# EAGLE design 10004_epic_cape (EAGLE 6.3)

## Sheet 1 of 3
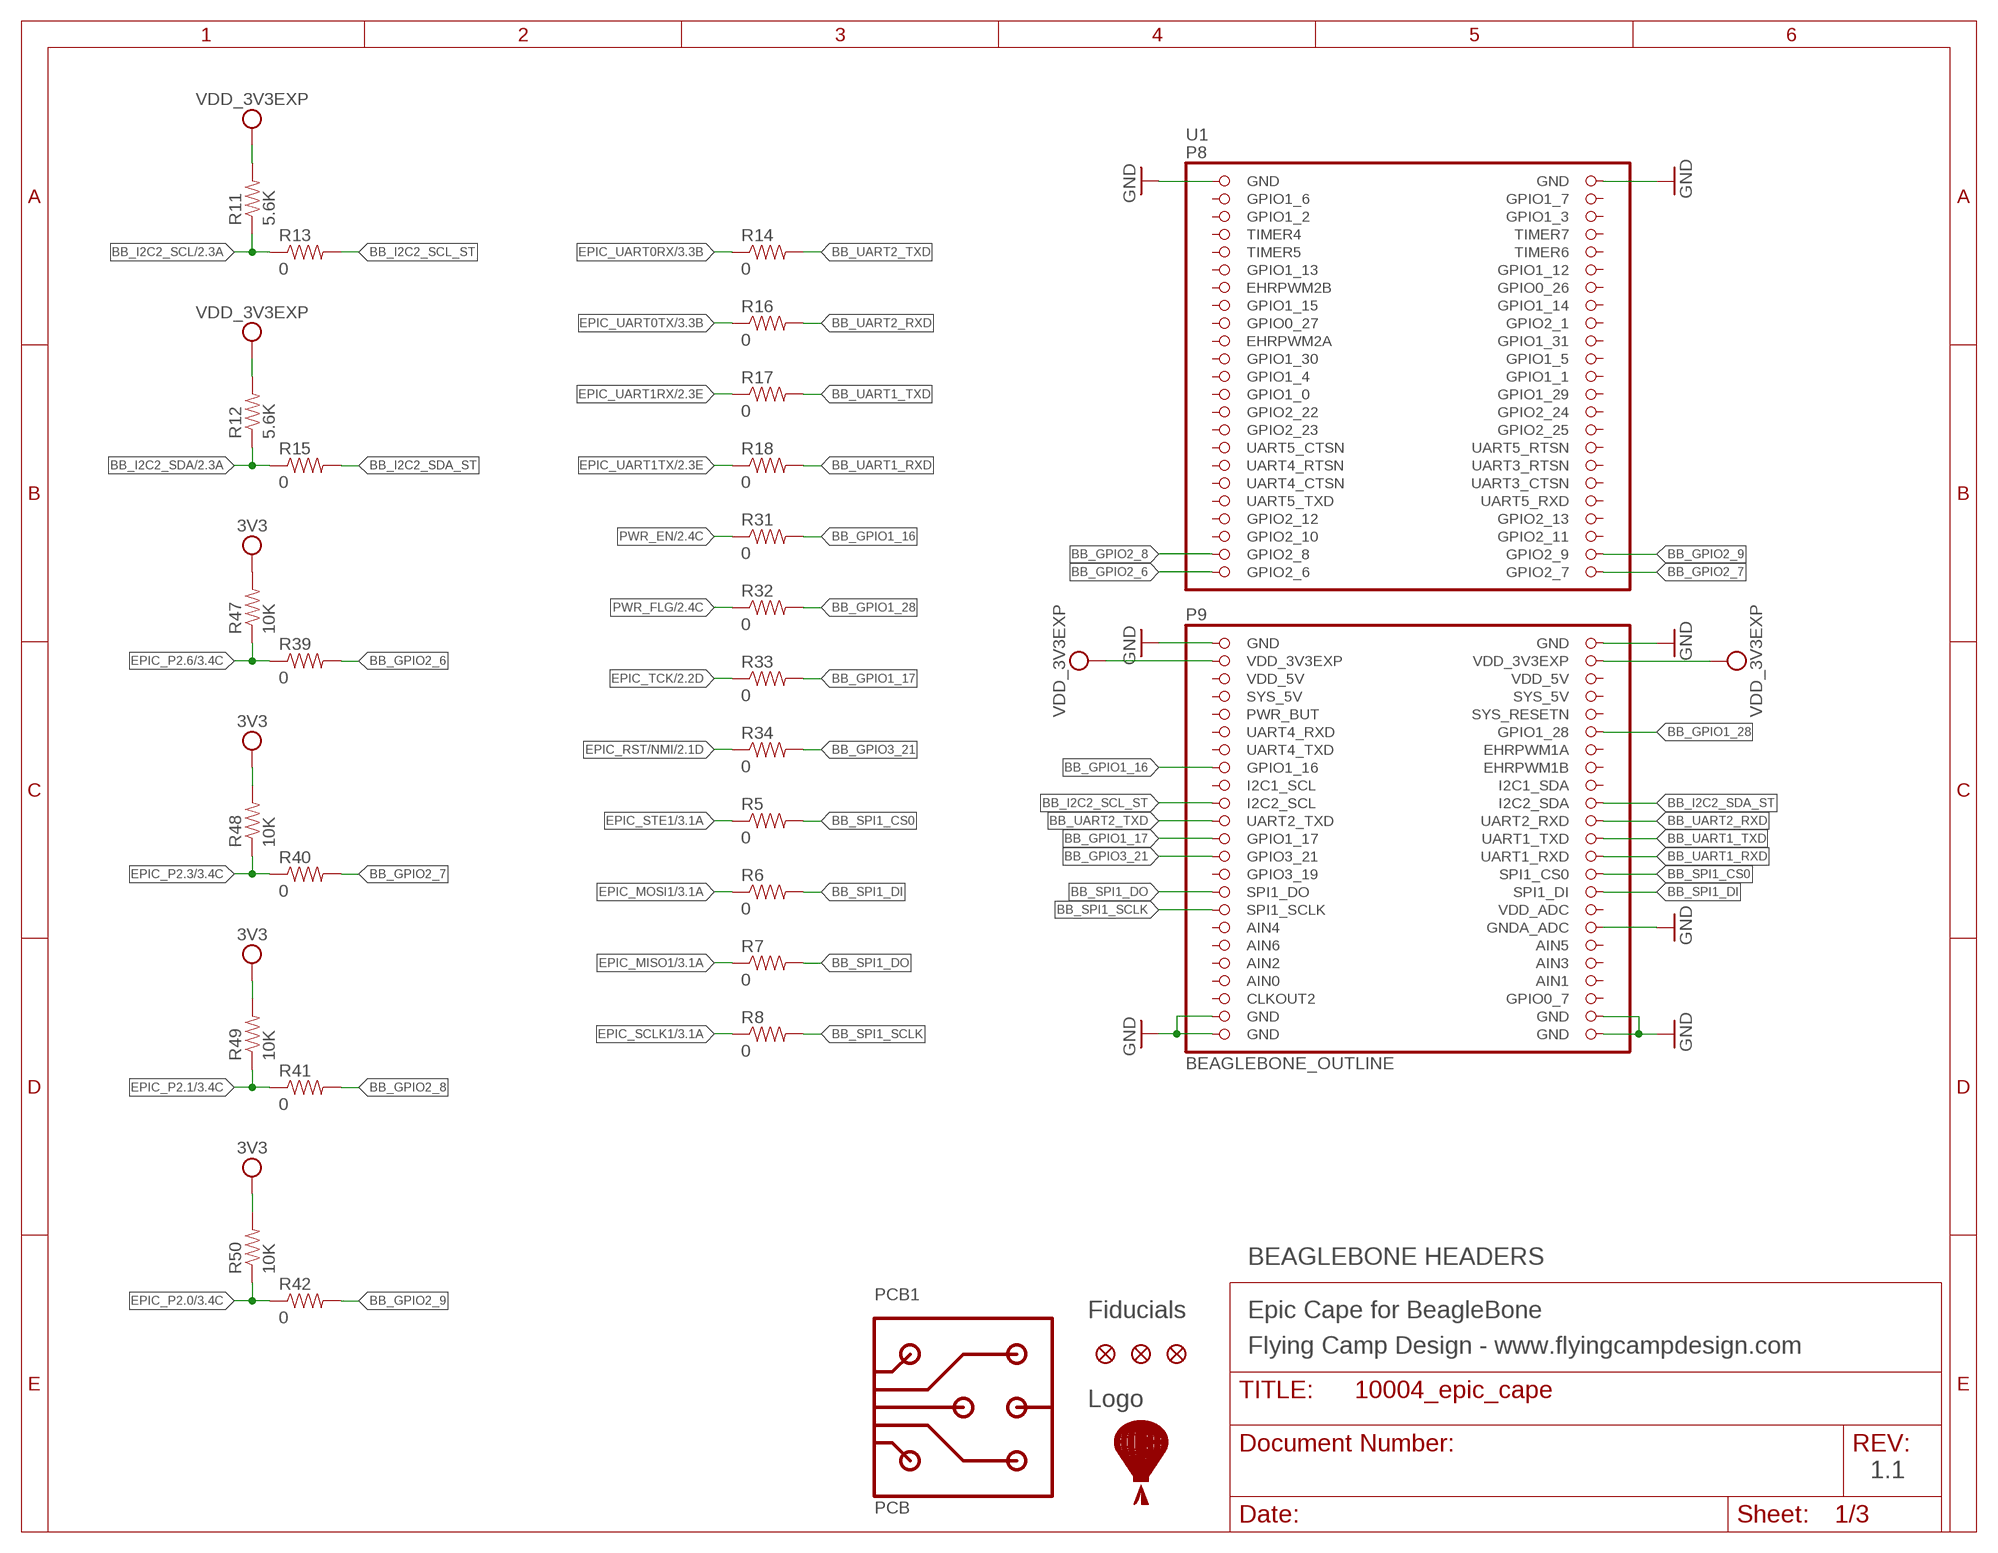
[diagram p0: schematic, sheet 1]
PCB1 (PCB): MFR: Flying Camp Design; MPN: 10004

### Parts
R5  0  RESISTOR1005  [RESC1005]
R6  0  RESISTOR1005  [RESC1005]
R7  0  RESISTOR1005  [RESC1005]
R8  0  RESISTOR1005  [RESC1005]
R11  5.6K  RESISTOR1005  [RESC1005]
R12  5.6K  RESISTOR1005  [RESC1005]
R13  0  RESISTOR1005  [RESC1005]
R14  0  RESISTOR1005  [RESC1005]
R15  0  RESISTOR1005  [RESC1005]
R16  0  RESISTOR1005  [RESC1005]
R17  0  RESISTOR1005  [RESC1005]
R18  0  RESISTOR1005  [RESC1005]
R31  0  RESISTOR1005  [RESC1005]
R32  0  RESISTOR1005  [RESC1005]
R33  0  RESISTOR1005  [RESC1005]
R34  0  RESISTOR1005  [RESC1005]
R39  0  RESISTOR1005  [RESC1005]
R40  0  RESISTOR1005  [RESC1005]
R41  0  RESISTOR1005  [RESC1005]
R42  0  RESISTOR1005  [RESC1005]
R47  10K  RESISTOR1005  [RESC1005]
R48  10K  RESISTOR1005  [RESC1005]
R49  10K  RESISTOR1005  [RESC1005]
R50  10K  RESISTOR1005  [RESC1005]
U1  BEAGLEBONE_OUTLINE  [BEAGLEBONE_SHIELD]
U$2  LOGO  [LOGO]
U$3  FIDUCIAL1X2.5  [FIDUCIAL-1X2.5]
U$4  FIDUCIAL1X2.5  [FIDUCIAL-1X2.5]
U$5  FIDUCIAL1X2.5  [FIDUCIAL-1X2.5]

### Nets
3V3: R47.2 R48.2 R49.2 R50.2 ; also sheet 2,3
BB_GPIO1_16: R31.2 U1.61(GPIO1_16)
BB_GPIO1_17: R33.2 U1.69(GPIO1_17)
BB_GPIO1_28: R32.2 U1.58(GPIO1_28)
BB_GPIO2_6: R39.2 U1.45(GPIO2_6)
BB_GPIO2_7: R40.2 U1.46(GPIO2_7)
BB_GPIO2_8: R41.2 U1.43(GPIO2_8)
BB_GPIO2_9: R42.2 U1.44(GPIO2_9)
BB_GPIO3_21: R34.2 U1.71(GPIO3_21)
BB_I2C2_SCL: R11.1 R13.1 ; also sheet 2
BB_I2C2_SCL_ST: R13.2 U1.65(I2C2_SCL)
BB_I2C2_SDA: R12.1 R15.1 ; also sheet 2
BB_I2C2_SDA_ST: R15.2 U1.66(I2C2_SDA)
BB_SPI1_CS0: R5.2 U1.74(SPI1_CS0)
BB_SPI1_DI: R6.2 U1.76(SPI1_DI)
BB_SPI1_DO: R7.2 U1.75(SPI1_DO)
BB_SPI1_SCLK: R8.2 U1.77(SPI1_SCLK)
BB_UART1_RXD: R18.2 U1.72(UART1_RXD)
BB_UART1_TXD: R17.2 U1.70(UART1_TXD)
BB_UART2_RXD: R16.2 U1.68(UART2_RXD)
BB_UART2_TXD: R14.2 U1.67(UART2_TXD)
EPIC_MISO1: R7.1 ; also sheet 3
EPIC_MOSI1: R6.1 ; also sheet 3
EPIC_P2.0: R42.1 R50.1 ; also sheet 3
EPIC_P2.1: R41.1 R49.1 ; also sheet 3
EPIC_P2.3: R40.1 R48.1 ; also sheet 3
EPIC_P2.6: R39.1 R47.1 ; also sheet 3
EPIC_RST/NMI: R34.1 ; also sheet 2,3
EPIC_SCLK1: R8.1 ; also sheet 3
EPIC_STE1: R5.1 ; also sheet 3
EPIC_TCK: R33.1 ; also sheet 2,3
EPIC_UART0RX: R14.1 ; also sheet 3
EPIC_UART0TX: R16.1 ; also sheet 3
EPIC_UART1RX: R17.1 ; also sheet 2,3
EPIC_UART1TX: R18.1 ; also sheet 2,3
GND: U1.1(GND) U1.2(GND) U1.47(GND) U1.48(GND) U1.80(GNDA_ADC) U1.89(GND) U1.90(GND) U1.91(GND) U1.92(GND) ; also sheet 2,3
PWR_EN: R31.1 ; also sheet 2
PWR_FLG: R32.1 ; also sheet 2
VDD_3V3EXP: R11.2 R12.2 U1.49(VDD_3V3EXP) U1.50(VDD_3V3EXP) ; also sheet 2
Unconnected: U1.5(GPIO1_2) U1.6(GPIO1_3) U1.7(TIMER4) U1.8(TIMER7) U1.9(TIMER5) U1.10(TIMER6) U1.11(GPIO1_13) U1.12(GPIO1_12) U1.13(EHRPWM2B) U1.14(GPIO0_26) U1.15(GPIO1_15) U1.16(GPIO1_14) U1.17(GPIO0_27) U1.18(GPIO2_1) U1.19(EHRPWM2A) U1.20(GPIO1_31) U1.21(GPIO1_30) U1.22(GPIO1_5) U1.23(GPIO1_4) U1.24(GPIO1_1) U1.25(GPIO1_0) U1.26(GPIO1_29) U1.27(GPIO2_22) U1.28(GPIO2_24) U1.29(GPIO2_23) U1.30(GPIO2_25) U1.31(UART5_CTSN) U1.32(UART5_RTSN) U1.33(UART4_RTSN) U1.34(UART3_RTSN) U1.35(UART4_CTSN) U1.36(UART3_CTSN) U1.37(UART5_TXD) U1.38(UART5_RXD) U1.39(GPIO2_12) U1.40(GPIO2_13) U1.41(GPIO2_10) U1.53(SYS_5V) U1.54(SYS_5V) U1.55(PWR_BUT) U1.56(SYS_RESETN) U1.57(UART4_RXD) U1.59(UART4_TXD) U1.60(EHRPWM1A) U1.62(EHRPWM1B) U1.63(I2C1_SCL) U1.64(I2C1_SDA) U1.73(GPIO3_19) U1.78(VDD_ADC) U1.79(AIN4) U1.81(AIN6) U1.82(AIN5) U1.83(AIN2) U1.86(AIN1) U1.87(CLKOUT2) U1.88(GPIO0_7)

### Notes on the sheet
- BEAGLEBONE HEADERS
- Fiducials | Epic Cape for BeagleBone
- Flying Camp Design - www.flyingcampdesign.com
- Logo
- 1.1

## Sheet 2 of 3
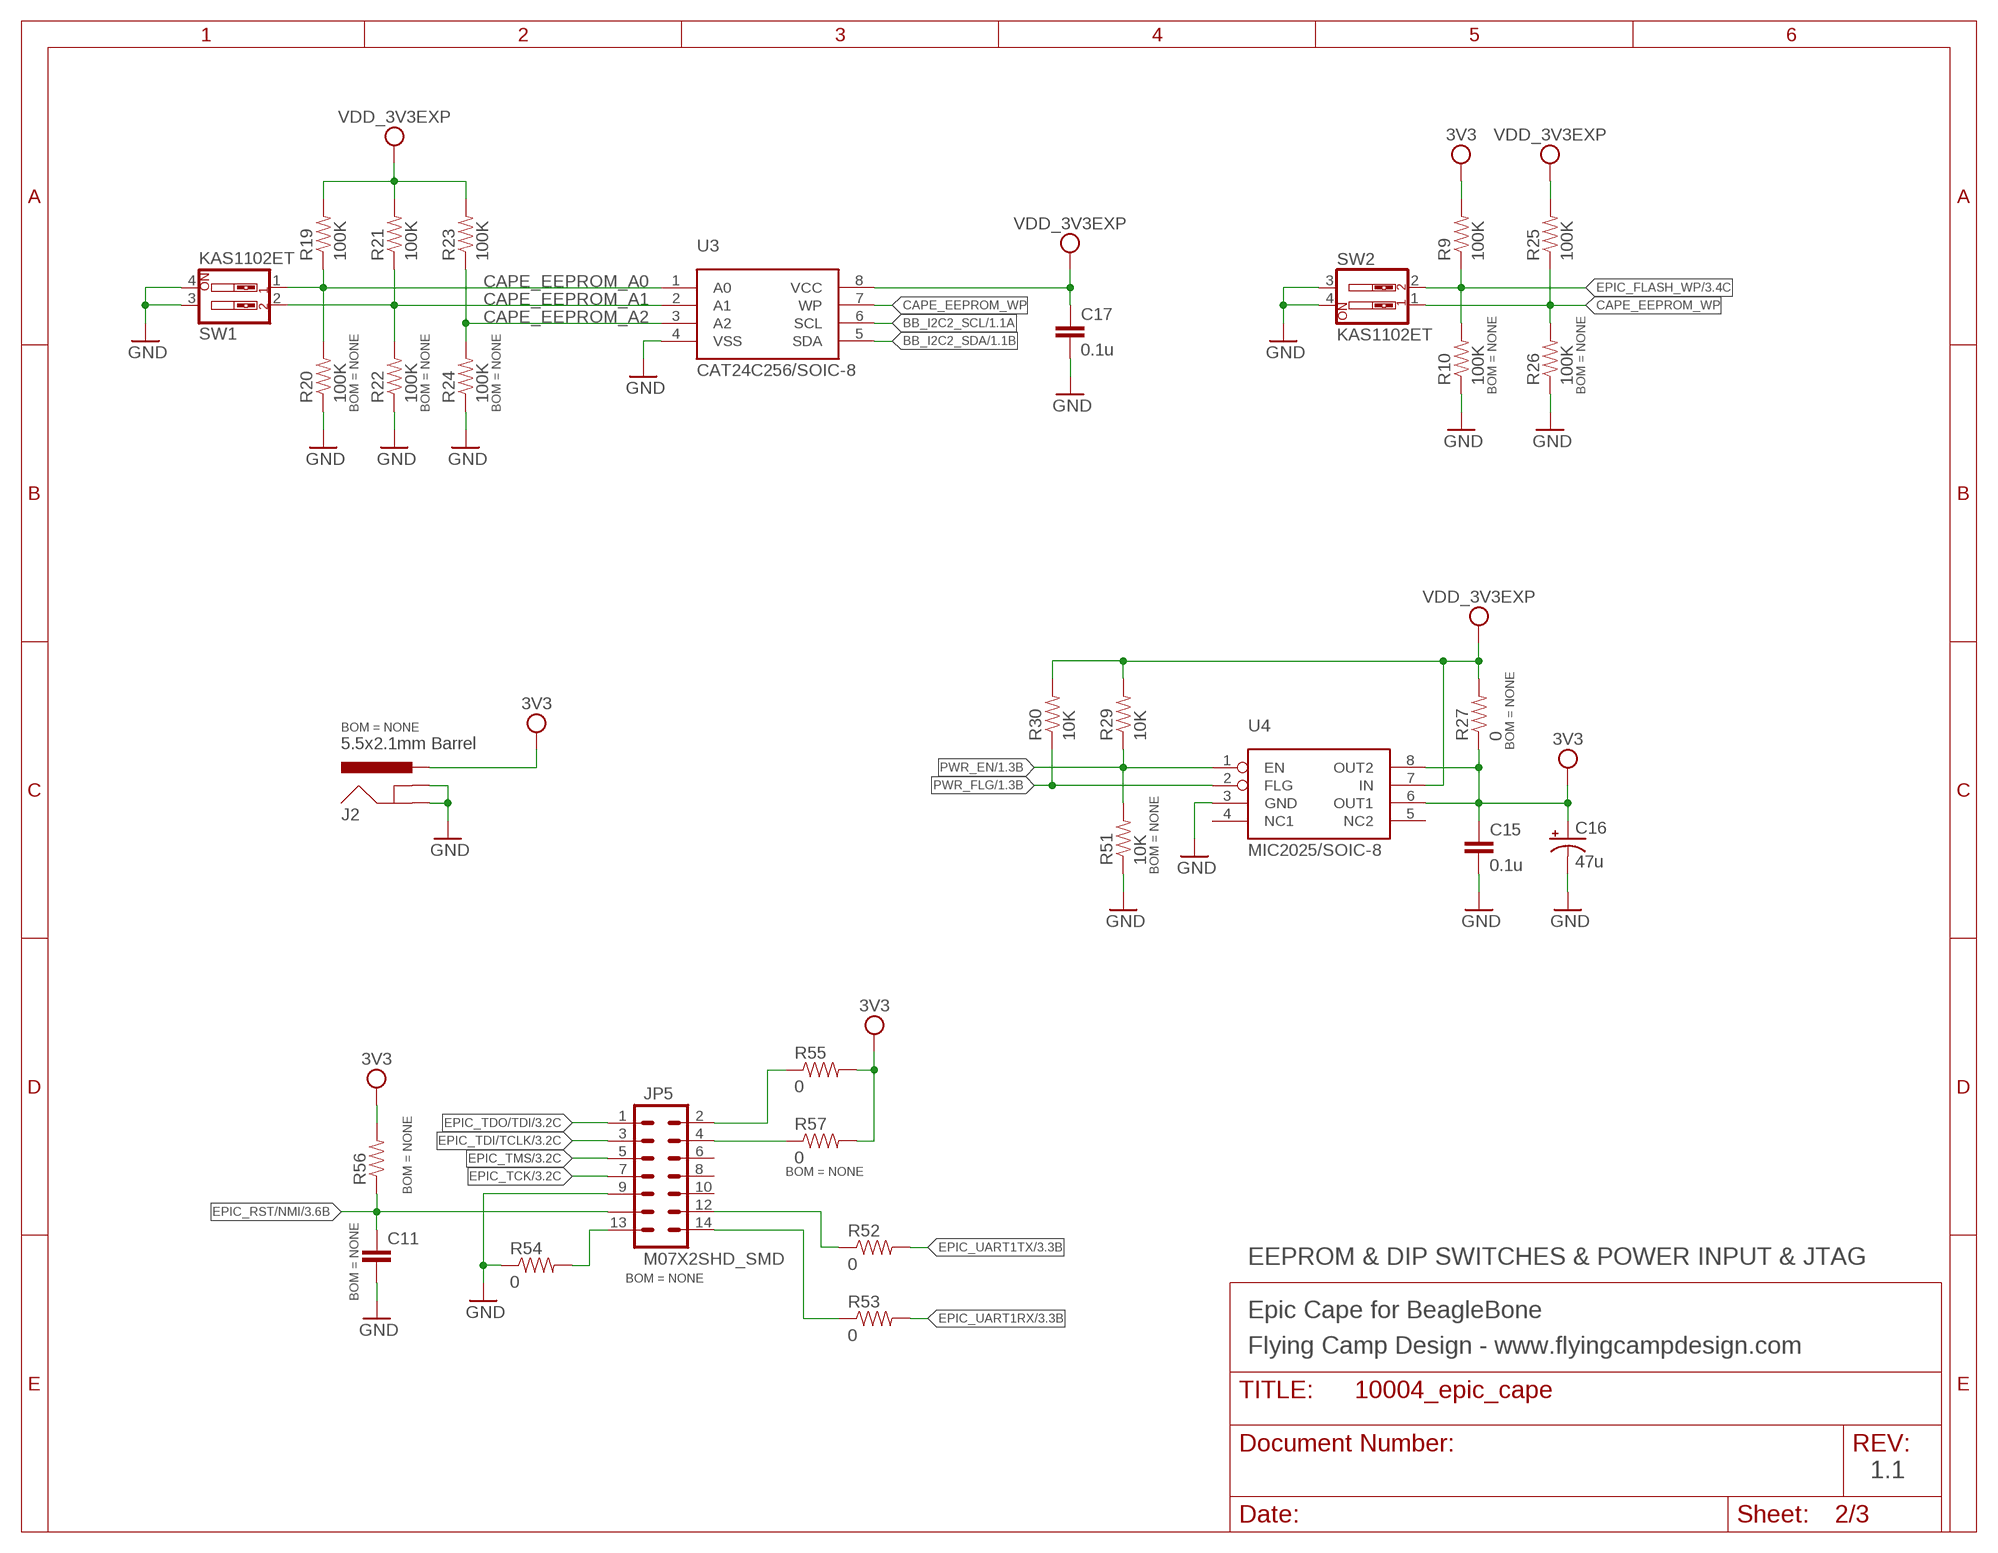
[diagram p1: schematic, sheet 2]

### Parts
C11  CAPACITOR1005  [CAPC1005]
C15  0.1u  CAPACITOR1005  [CAPC1005]
C16  47u  CAP_POL/1206  [EIA3216]
C17  0.1u  CAPACITOR1005  [CAPC1005]
J2  5.5x2.1mm Barrel  POWER_JACKSMD  [POWER_JACK_SMD]
JP5  M07X2SHD_SMD  [2X7-SHROUDED_SMD]
R9  100K  RESISTOR1005  [RESC1005]
R10  100K  RESISTOR1005  [RESC1005]
R19  100K  RESISTOR1005  [RESC1005]
R20  100K  RESISTOR1005  [RESC1005]
R21  100K  RESISTOR1005  [RESC1005]
R22  100K  RESISTOR1005  [RESC1005]
R23  100K  RESISTOR1005  [RESC1005]
R24  100K  RESISTOR1005  [RESC1005]
R25  100K  RESISTOR1005  [RESC1005]
R26  100K  RESISTOR1005  [RESC1005]
R27  0  RESISTOR3216  [RESC3216]
R29  10K  RESISTOR1005  [RESC1005]
R30  10K  RESISTOR1005  [RESC1005]
R51  10K  RESISTOR1005  [RESC1005]
R52  0  RESISTOR1005  [RESC1005]
R53  0  RESISTOR1005  [RESC1005]
R54  0  RESISTOR1005  [RESC1005]
R55  0  RESISTOR1005  [RESC1005]
R56  RESISTOR1005  [RESC1005]
R57  0  RESISTOR1005  [RESC1005]
SW1  KAS1102ET  SW_DIP-2  [DIPSWITCH-02]
SW2  KAS1102ET  SW_DIP-2  [DIPSWITCH-02]
U3  CAT24C256/SOIC-8  [SOIC-8]
U4  MIC2025/SOIC-8  [SOIC-8]

### Nets
3V3: C15.1 C16.A(+) J2.VIN0(PWR) R9.2 R27.1 R55.2 R56.2 R57.2 U4.6(OUT1) U4.8(OUT2) ; also sheet 1,3
BB_I2C2_SCL: U3.6(SCL) ; also sheet 1
BB_I2C2_SDA: U3.5(SDA) ; also sheet 1
CAPE_EEPROM_A0: R19.1 R20.2 SW1.1 U3.1(A0)
CAPE_EEPROM_A1: R21.1 R22.2 SW1.2 U3.2(A1)
CAPE_EEPROM_A2: R23.1 R24.2 U3.3(A2)
CAPE_EEPROM_WP: R25.1 R26.2 SW2.1 U3.7(WP)
EPIC_FLASH_WP: R9.1 R10.2 SW2.2 ; also sheet 3
EPIC_RST/NMI: C11.1 JP5.11 R56.1 ; also sheet 1,3
EPIC_TCK: JP5.7 ; also sheet 1,3
EPIC_TDI/TCLK: JP5.3 ; also sheet 3
EPIC_TDO/TDI: JP5.1 ; also sheet 3
EPIC_TMS: JP5.5 ; also sheet 3
EPIC_UART1RX: R53.2 ; also sheet 1,3
EPIC_UART1TX: R52.2 ; also sheet 1,3
GND: C11.2 C15.2 C16.C(-) C17.2 J2.GND(GNDBREAK) J2.P$4(GND) JP5.9 R10.1 R20.1 R22.1 R24.1 R26.1 R51.1 R54.1 SW1.3 SW1.4 SW2.3 SW2.4 U3.4(VSS) U4.3(GND) ; also sheet 1,3
N$3: JP5.13 R54.2
N$18: JP5.12 R52.1
N$20: JP5.14 R53.1
PWR_EN: R29.1 R51.2 U4.1(EN) ; also sheet 1
PWR_FLG: R30.1 U4.2(FLG) ; also sheet 1
VCCTARGET: JP5.4 R57.1
VCCTOOL: JP5.2 R55.1
VDD_3V3EXP: C17.1 R19.2 R21.2 R23.2 R25.2 R27.2 R29.2 R30.2 U3.8(VCC) U4.7(IN) ; also sheet 1
Unconnected: JP5.6 JP5.8 JP5.10 U4.4(NC1) U4.5(NC2)

### Notes on the sheet
- EEPROM & DIP SWITCHES & POWER INPUT & JTAG
- Epic Cape for BeagleBone
- Flying Camp Design - www.flyingcampdesign.com
- 1.1

## Sheet 3 of 3
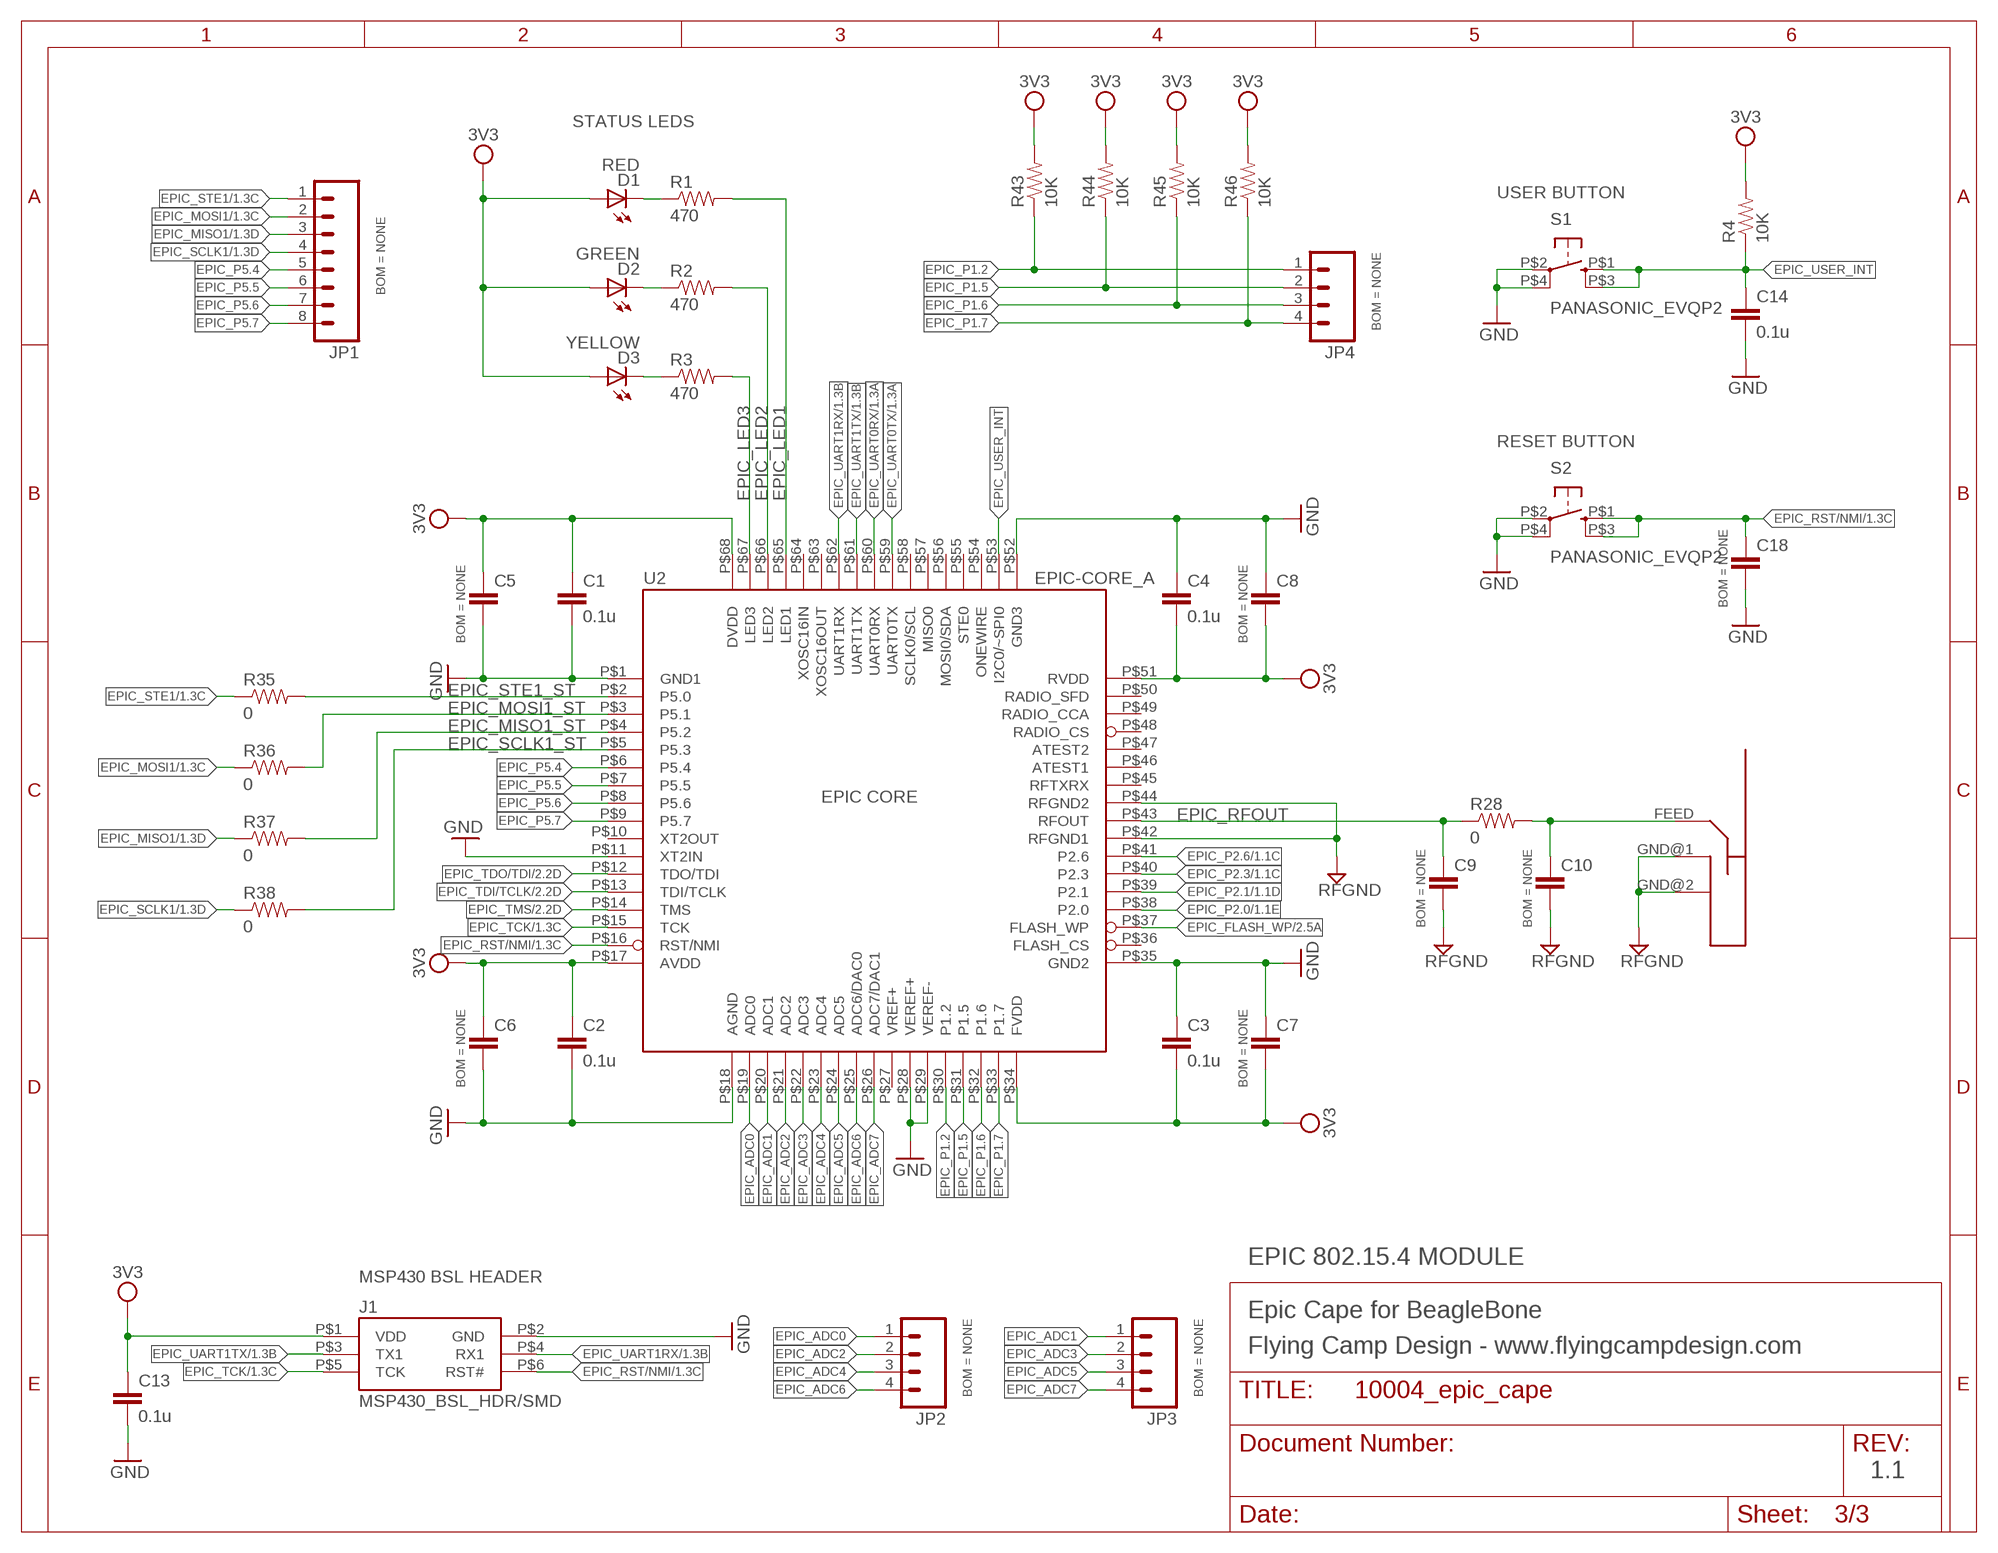
[diagram p2: schematic, sheet 3]

### Parts
ANT1  2.4GHZ_INVERTED_F_ANTENNA  [2.4GHZ_INVERTED_F_ANTENNA]
C1  0.1u  CAPACITOR1005  [CAPC1005]
C2  0.1u  CAPACITOR1005  [CAPC1005]
C3  0.1u  CAPACITOR1005  [CAPC1005]
C4  0.1u  CAPACITOR1005  [CAPC1005]
C5  CAPACITOR2012  [CAPC2012]
C6  CAPACITOR2012  [CAPC2012]
C7  CAPACITOR2012  [CAPC2012]
C8  CAPACITOR2012  [CAPC2012]
C9  CAPACITOR1005  [CAPC1005]
C10  CAPACITOR1005  [CAPC1005]
C13  0.1u  CAPACITOR1005  [CAPC1005]
C14  0.1u  CAPACITOR1005  [CAPC1005]
C18  CAPACITOR1005  [CAPC1005]
D1  RED  LED1608  [LEDC1608]
D2  GREEN  LED1608  [LEDC1608]
D3  YELLOW  LED1608  [LEDC1608]
J1  MSP430_BSL_HDR/SMD  [HIROSE_DF11G-XXDP-2V]
JP1  M081X08  [1X08]
JP2  M04PTH  [1X04]
JP3  M04PTH  [1X04]
JP4  M04PTH  [1X04]
R1  470  RESISTOR1005  [RESC1005]
R2  470  RESISTOR1005  [RESC1005]
R3  470  RESISTOR1005  [RESC1005]
R4  10K  RESISTOR1005  [RESC1005]
R28  0  RESISTOR1005  [RESC1005]
R35  0  RESISTOR1005  [RESC1005]
R36  0  RESISTOR1005  [RESC1005]
R37  0  RESISTOR1005  [RESC1005]
R38  0  RESISTOR1005  [RESC1005]
R43  10K  RESISTOR1005  [RESC1005]
R44  10K  RESISTOR1005  [RESC1005]
R45  10K  RESISTOR1005  [RESC1005]
R46  10K  RESISTOR1005  [RESC1005]
S1  PANASONIC_EVQP2  [PANASONIC_EVQP2]
S2  PANASONIC_EVQP2  [PANASONIC_EVQP2]
U2  EPIC-CORE_A  [EPIC_LCC68]

### Nets
3V3: C1.1 C2.1 C3.2 C4.2 C5.1 C6.1 C7.2 C8.2 C13.1 D1.A D2.A D3.A J1.P$1(VDD) R4.2 R43.2 R44.2 R45.2 R46.2 U2.P$17(AVDD) U2.P$34(FVDD) U2.P$51(RVDD) U2.P$68(DVDD) ; also sheet 1,2
EPIC_ADC0: JP2.1 U2.P$19(ADC0)
EPIC_ADC1: JP3.1 U2.P$20(ADC1)
EPIC_ADC2: JP2.2 U2.P$21(ADC2)
EPIC_ADC3: JP3.2 U2.P$22(ADC3)
EPIC_ADC4: JP2.3 U2.P$23(ADC4)
EPIC_ADC5: JP3.3 U2.P$24(ADC5)
EPIC_ADC6: JP2.4 U2.P$25(ADC6/DAC0)
EPIC_ADC7: JP3.4 U2.P$26(ADC7/DAC1)
EPIC_FLASH_WP: U2.P$37(FLASH_WP) ; also sheet 2
EPIC_LED1: R1.2 U2.P$65(LED1)
EPIC_LED2: R2.2 U2.P$66(LED2)
EPIC_LED3: R3.2 U2.P$67(LED3)
EPIC_MISO1: JP1.3 R37.1 ; also sheet 1
EPIC_MISO1_ST: R37.2 U2.P$4(P5.2)
EPIC_MOSI1: JP1.2 R36.1 ; also sheet 1
EPIC_MOSI1_ST: R36.2 U2.P$3(P5.1)
EPIC_P1.2: JP4.1 R43.1 U2.P$30(P1.2)
EPIC_P1.5: JP4.2 R44.1 U2.P$31(P1.5)
EPIC_P1.6: JP4.3 R45.1 U2.P$32(P1.6)
EPIC_P1.7: JP4.4 R46.1 U2.P$33(P1.7)
EPIC_P2.0: U2.P$38(P2.0) ; also sheet 1
EPIC_P2.1: U2.P$39(P2.1) ; also sheet 1
EPIC_P2.3: U2.P$40(P2.3) ; also sheet 1
EPIC_P2.6: U2.P$41(P2.6) ; also sheet 1
EPIC_P5.4: JP1.5 U2.P$6(P5.4)
EPIC_P5.5: JP1.6 U2.P$7(P5.5)
EPIC_P5.6: JP1.7 U2.P$8(P5.6)
EPIC_P5.7: JP1.8 U2.P$9(P5.7)
EPIC_RFOUT [rfout]: C9.1 R28.1 U2.P$43(RFOUT)
EPIC_RST/NMI: C18.1 J1.P$6(RST#) S2.P$1 S2.P$3 U2.P$16(RST/NMI) ; also sheet 1,2
EPIC_SCLK1: JP1.4 R38.1 ; also sheet 1
EPIC_SCLK1_ST: R38.2 U2.P$5(P5.3)
EPIC_STE1: JP1.1 R35.1 ; also sheet 1
EPIC_STE1_ST: R35.2 U2.P$2(P5.0)
EPIC_TCK: J1.P$5(TCK) U2.P$15(TCK) ; also sheet 1,2
EPIC_TDI/TCLK: U2.P$13(TDI/TCLK) ; also sheet 2
EPIC_TDO/TDI: U2.P$12(TDO/TDI) ; also sheet 2
EPIC_TMS: U2.P$14(TMS) ; also sheet 2
EPIC_UART0RX: U2.P$60(UART0RX) ; also sheet 1
EPIC_UART0TX: U2.P$59(UART0TX) ; also sheet 1
EPIC_UART1RX: J1.P$4(RX1) U2.P$62(UART1RX) ; also sheet 1,2
EPIC_UART1TX: J1.P$3(TX1) U2.P$61(UART1TX) ; also sheet 1,2
EPIC_USER_INT: C14.1 R4.1 S1.P$1 S1.P$3 U2.P$53(I2C0/~SPI0)
FEED [rfout]: ANT1.FEED C10.1 R28.2
GND: C1.2 C2.2 C3.1 C4.1 C5.2 C6.2 C7.1 C8.1 C13.2 C14.2 C18.2 J1.P$2(GND) S1.P$2 S1.P$4 S2.P$2 S2.P$4 U2.P$1(GND1) U2.P$11(XT2IN) U2.P$18(AGND) U2.P$28(VEREF+) U2.P$29(VEREF-) U2.P$35(GND2) U2.P$52(GND3) ; also sheet 1,2
N$9: D1.C R1.1
N$10: D2.C R2.1
N$11: D3.C R3.1
RFGND: ANT1.GND@1(GND) ANT1.GND@2(GND) C9.2 C10.2 U2.P$42(RFGND1) U2.P$44(RFGND2)
Unconnected: U2.P$10(XT2OUT) U2.P$27(VREF+) U2.P$36(FLASH_CS) U2.P$45(RFTXRX) U2.P$46(ATEST1) U2.P$47(ATEST2) U2.P$48(RADIO_CS) U2.P$49(RADIO_CCA) U2.P$50(RADIO_SFD) U2.P$54(ONEWIRE) U2.P$55(STE0) U2.P$56(MOSI0/SDA) U2.P$57(MISO0) U2.P$58(SCLK0/SCL) U2.P$63(XOSC16OUT) U2.P$64(XOSC16IN)

### Notes on the sheet
- STATUS LEDS
- USER BUTTON
- RESET BUTTON
- EPIC CORE
- EPIC 802.15.4 MODULE
- MSP430 BSL HEADER
- Epic Cape for BeagleBone
- Flying Camp Design - www.flyingcampdesign.com
- 1.1

## Power pins joined to a net without a drawn wire
AIN0: U1.85(AIN0)
AIN3: U1.84(AIN3)
GPIO1_6: U1.3(GPIO1_6)
GPIO1_7: U1.4(GPIO1_7)
GPIO2_11: U1.42(GPIO2_11)
VDD_5V: U1.51(VDD_5V) U1.52(VDD_5V)

## Library data of the parts
ANT1 = fcd:2.4GHZ_INVERTED_F_ANTENNA: 2.4 GHz Inverted F Antenna See swru120 <www.ti.com/lit/pdf/swru120> for more details. Extracted from Inverted_F_Antenna.spl Gerber file found in swrr034 <www.ti.com/lit/zip/swrr034>.; BOM: NONE
C1-C4 C13-C15 C17 = fcd:CAPACITOR: Capacitor; COST: 0.01350; MFR: Kemet; MPN: C0402C104K9RACTU
C5-C11 C18 = fcd:CAPACITOR: Capacitor; BOM: NONE
C16 = fcd:CAP_POL: Capacitor Polarized These are standard SMD and PTH capacitors. Normally 10uF, 47uF, and 100uF in electrolytic and tantalum varieties. Always verify the external diameter of the through hole cap, it varies with capacity, voltage, and manufacturer. The EIA devices should be standard.; COST: 0.23513; MFR: Kemet; MPN: T491A476M006AT
D1 = fcd:LED: LED; COST: 0.07500; MFR: Everlight; MPN: QTLP600C7TR
D2 = fcd:LED: LED; COST: 0.09250; MFR: Everlight; MPN: QTLP601C4TR
D3 = fcd:LED: LED; COST: 0.07600; MFR: Everlight; MPN: QTLP600CYTR
J1 = fcd:MSP430_BSL_HDR: MSP430 BSL Programming Header Mating header for the Flying Camp Design MSP430 BSL Programmer <http://www.flyingcampdesign.com/msp430-bsl-programmer.html>.; COST: 0.74704; MFR: Hirose; MPN: DF11G-6DP-2V(50)
J2 = SparkFun-Connectors:POWER_JACK: Power Jack This is the standard 5.5mm barrel jack for power. The PTH is the most common, proven, reliable, footprint. The Slot footprint only works if the mill layer is transmitted to the PCB fab house so be warned. Spark Fun Electronics SKU : PRT-00119 SMT: CONN-08106 Mating wall wart : TOL-00298 (and others); BOM: NONE; PROD_ID: CONN-08106
JP1 = fcd:M08: Header 8; BOM: NONE
JP2-JP4 = fcd:M04: Header 4; BOM: NONE
JP5 = fcd:M07X2: Header 7x2; BOM: NONE
R1-R3 = fcd:RESISTOR: Resistor; COST: 0.00672; MFR: Panasonic; MPN: ERJ-2RKF4700X
R4 R29 R30 R43-R50 = fcd:RESISTOR: Resistor; COST: 0.00672; MFR: Panasonic; MPN: ERJ-2RKF1002X
R5-R8 R13-R18 R28 R31-R42 R52-R55 = fcd:RESISTOR: Resistor; COST: 0.00480; MFR: Panasonic; MPN: ERJ-2GE0R00X
R9 R19 R21 R23 R25 = fcd:RESISTOR: Resistor; COST: 0.00672; MFR: Panasonic; MPN: ERJ-2RKF1003X
R10 R20 R22 R24 R26 = fcd:RESISTOR: Resistor; BOM: NONE; COST: 0.00672; MFR: Panasonic; MPN: ERJ-2RKF1003X
R11 R12 = fcd:RESISTOR: Resistor; COST: 0.00672; MFR: Panasonic; MPN: ERJ-2RKF5601X
R27 = fcd:RESISTOR: Resistor; BOM: NONE; COST: 0.00672; MFR: Panasonic; MPN: ERJ-8GEY0R00V
R51 = fcd:RESISTOR: Resistor; BOM: NONE; COST: 0.00672; MFR: Panasonic; MPN: ERJ-2RKF1002X
R56 = fcd:RESISTOR: Resistor; BOM: NONE
R57 = fcd:RESISTOR: Resistor; BOM: NONE; COST: 0.00480; MFR: Panasonic; MPN: ERJ-2GE0R00X
S1 S2 = fcd:PANASONIC_EVQP2: SMD Light Touch Switch; COST: 0.45619; MFR: Panasonic; MPN: EVQ-P2K02Q
SW1 SW2 = fcd:SW_DIP-2: Dip Switch; COST: 0.77000; MFR: E-Switch; MPN: KAS1102ET
U1 = fcd:BEAGLEBONE_OUTLINE: BeagleBone Cape Outline Should match A3 pinout - but not completely tested; BOM: NONE
U2 = fcd:EPIC-CORE_A: Epic Core Epic: An Open Mote Platform for Application-Driven Design See http://www.cs.berkeley.edu/~prabal/projects/epic/ for Open Source hardware design files.; COST: 49.00; MFR: Moteware; MPN: EPIC-CORE-PCB
U3 = fcd:CAT24C: EEPROM 256KBit 400KHz; COST: 0.28463; MFR: ON Semiconductor; MPN: CAT24C256WI-GT3
U4 = fcd:MIC2025: Single-Channel Power Distribution Switch; COST: 0.60200; MFR: Micrel; MPN: MIC2025-1YM
U$2 = fcd:LOGO: Flying Camp Design Logo; BOM: NONE
U$3-U$5 = SparkFun:FIDUCIAL: Fiducial Alignment Points Various fiducial points for machine vision alignment.; BOM: NONE

## Net classes
0 default: width 0.203 mm
1 rfout: width 0.457 mm

## Board
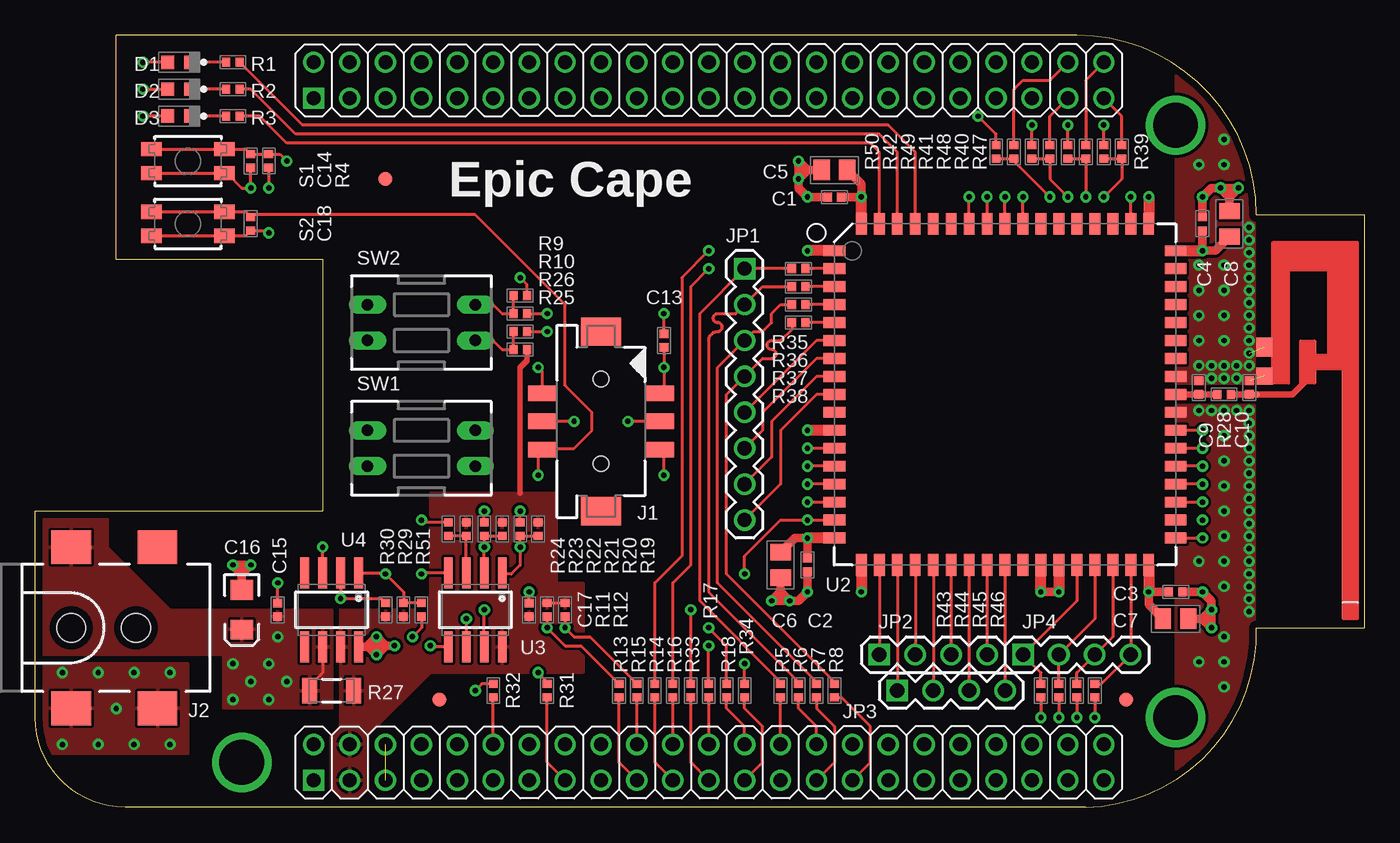
[diagram p3: board, top side]
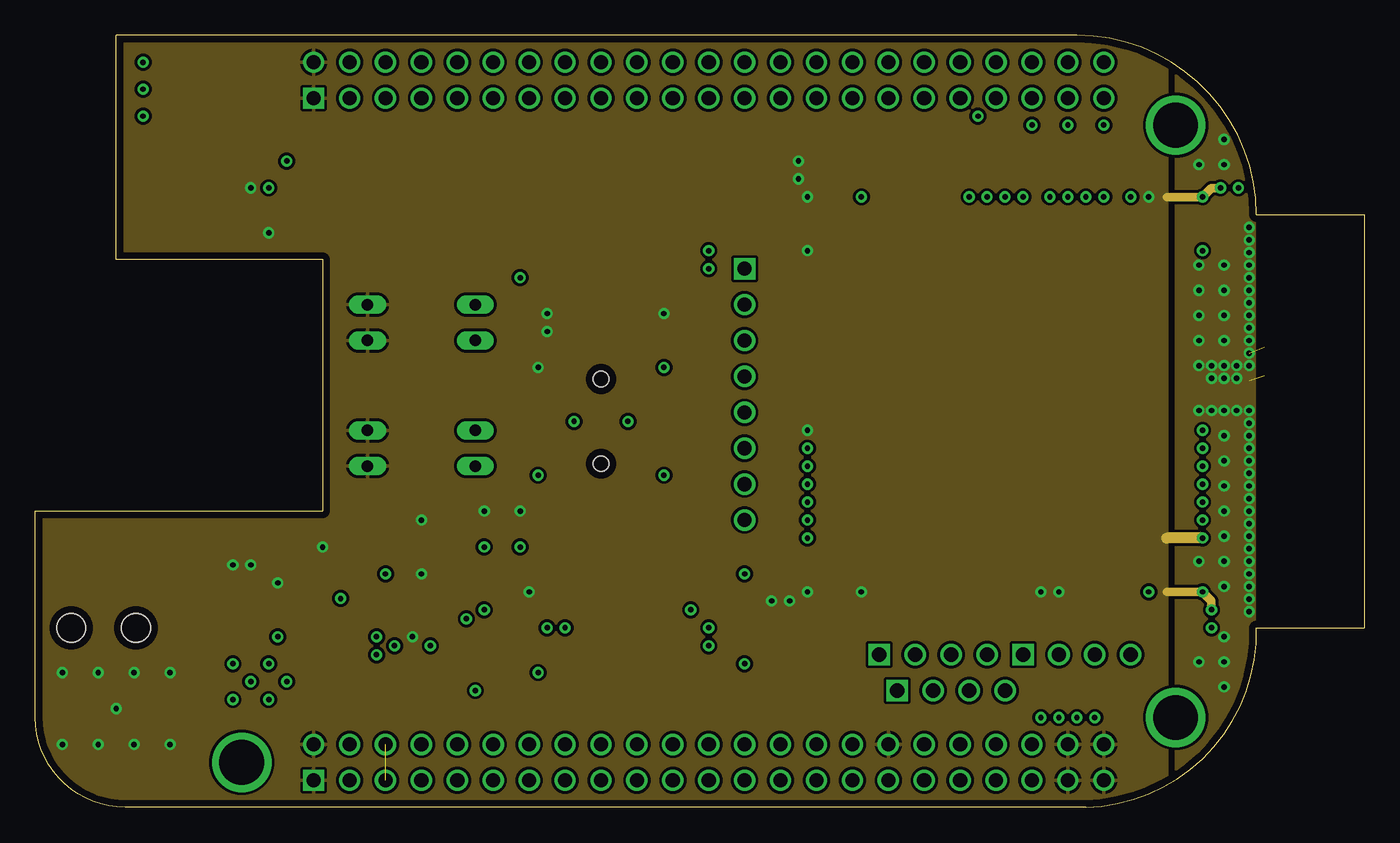
[diagram p4: board, inner layer GND]
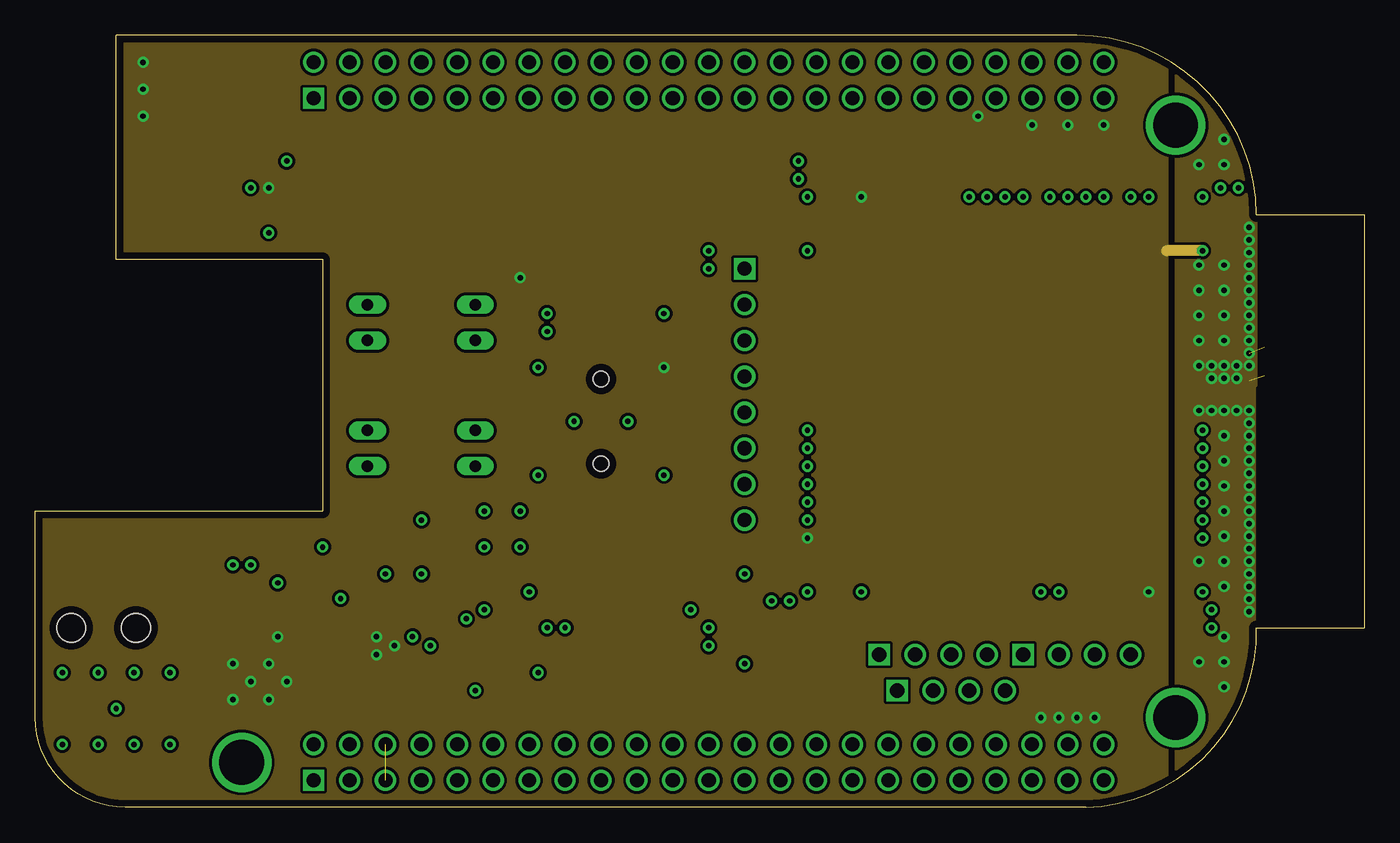
[diagram p5: board, inner layer VCC]
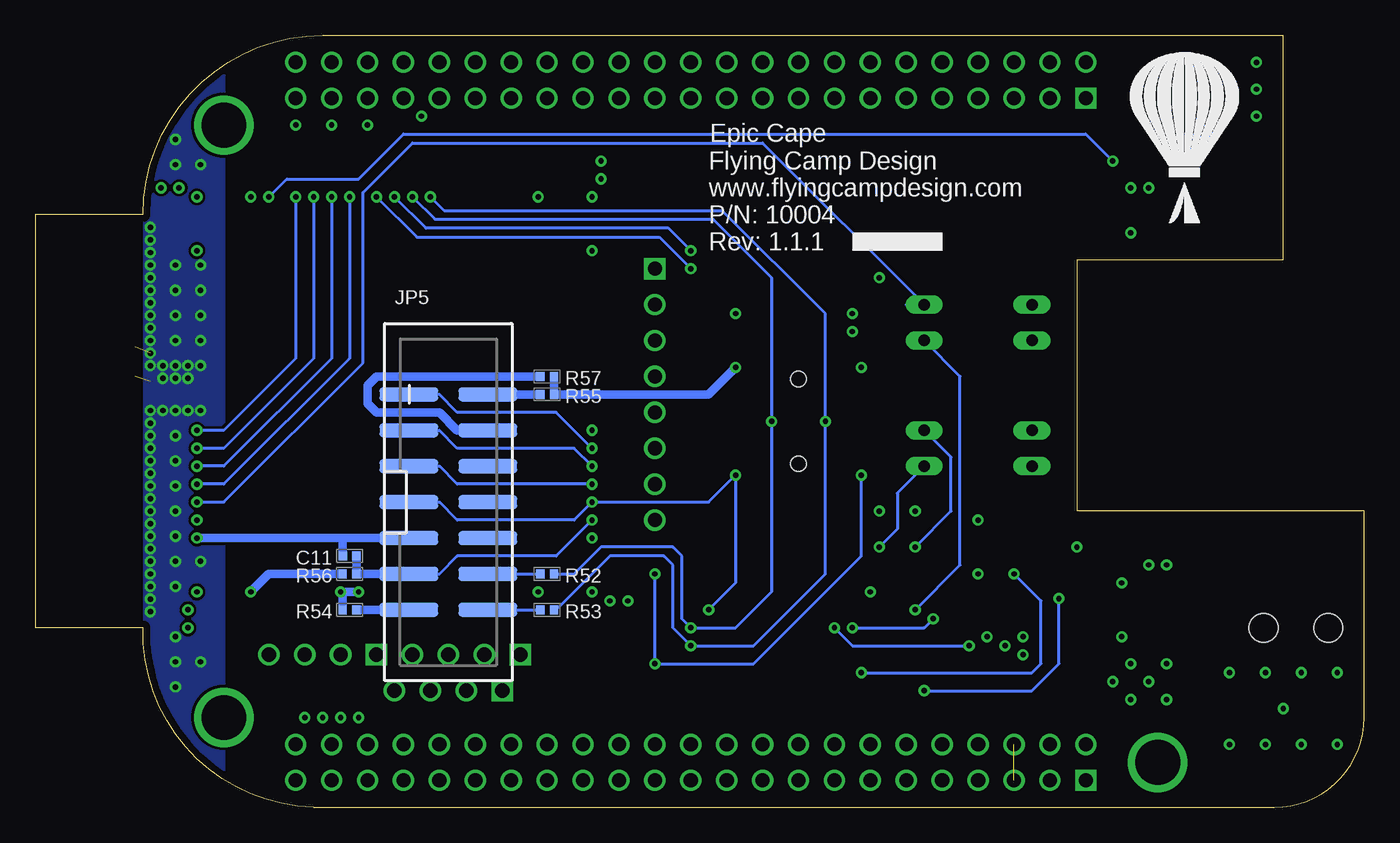
[diagram p6: board, bottom side, seen from below]

Size 93.98 x 54.61 mm. Coordinates in mm from the lower left corner, seen from the top.
Copper layers (1+2*15+16): TOP 0.034290625mm / dielectric 0.23621875mm / GND 0.034290625mm / dielectric 39mil / VCC 0.034290625mm / dielectric 0.23621875mm / BOT 0.034290625mm
Design rules "66each": minimum track width 8mil, minimum drill 15mil, track to track 8mil, track to pad 8mil, pad to pad 8mil, via to via 8mil, smd to smd 0mil, copper to edge 20mil, drill to drill 8mil, minimum pad ring 10mil, minimum via ring 8mil, stop-mask expansion 2.5mil, vias tented up to drill 20mil, thermal gap 8mil

### Footprints (pad centres in the part's own frame; a part is rotated, then mirrored left to right if it is on the bottom)
2.4GHZ_INVERTED_F_ANTENNA = smd 0.457 x 0.457: FEED 0,0 | smd 1.204 x 1.153: GND@1 -1.288,0.551 | smd 1.351 x 1.153: GND@2 -3.363,0.551
CAPC1005 = smd 0.59 x 0.64: 1 -0.48,0; 2 0.48,0
CAPC2012 = smd 1.15 x 1.45: 1 -0.9,0; 2 0.9,0
EIA3216 = smd 1.4 x 1.6: A 1.4,0; C -1.4,0
LEDC1608 = smd 0.9 x 0.95: A 0.8,0; C -0.8,0
HIROSE_DF11G-XXDP-2V = smd 1.1 x 2: P$1 2,-4.15; P$2 2,4.15; P$3 0,-4.15; P$4 0,4.15; P$5 -2,-4.15; P$6 -2,4.15 | smd 2 x 2.8: P$12 -6.35,0; P$83 6.35,0 | hole 1.1: -3,0; 3,0
POWER_JACK_SMD = smd 2.8 x 2.4: GND 0,-5.7; P$4 6.1,-5.7; VIN0 0,5.7; VIN1 6.1,5.7 | hole 2.032: 0,0; 4.572,0
1X08 = drill 1 square: 1 0,0 | drill 1: 2 2.54,0; 3 5.08,0; 4 7.62,0; 5 10.16,0; 6 12.7,0; 7 15.24,0; 8 17.78,0
1X04 = drill 1.016 square: 1 0,0 | drill 1.016: 2 2.54,0; 3 5.08,0; 4 7.62,0
2X7-SHROUDED_SMD = smd 4.15 x 1: 1 -2.794,7.62; 2 2.794,7.62; 3 -2.794,5.08; 4 2.794,5.08; 5 -2.794,2.54; 6 2.794,2.54; 7 -2.794,0; 8 2.794,0; 9 -2.794,-2.54; 10 2.794,-2.54; 11 -2.794,-5.08; 12 2.794,-5.08; 13 -2.794,-7.62; 14 2.794,-7.62
RESC1005 = smd 0.57 x 0.62: 1 -0.48,0; 2 0.48,0
RESC3216 = smd 1.05 x 1.8: 1 -1.55,0; 2 1.55,0
PANASONIC_EVQP2 = smd 1.45 x 1: P$1 2.575,0.85; P$2 2.575,-0.85; P$3 -2.575,0.85; P$4 -2.575,-0.85
DIPSWITCH-02 = drill 0.813 long: 1 -1.27,-3.81; 2 1.27,-3.81; 3 1.27,3.81; 4 -1.27,3.81
BEAGLEBONE_SHIELD = drill 1 square: 1 19.685,50.165; 47 19.685,1.905 | drill 1: 2 19.685,52.705; 3 22.225,50.165; 4 22.225,52.705; 5 24.765,50.165; 6 24.765,52.705; 7 27.305,50.165; 8 27.305,52.705; 9 29.845,50.165; 10 29.845,52.705; 11 32.385,50.165; 12 32.385,52.705; 13 34.925,50.165; 14 34.925,52.705; 15 37.465,50.165; 16 37.465,52.705; 17 40.005,50.165; 18 40.005,52.705; 19 42.545,50.165; 20 42.545,52.705; 21 45.085,50.165; 22 45.085,52.705; 23 47.625,50.165; 24 47.625,52.705; 25 50.165,50.165; 26 50.165,52.705; 27 52.705,50.165; 28 52.705,52.705; 29 55.245,50.165; 30 55.245,52.705; 31 57.785,50.165; 32 57.785,52.705; 33 60.325,50.165; 34 60.325,52.705; 35 62.865,50.165; 36 62.865,52.705; 37 65.405,50.165; 38 65.405,52.705; 39 67.945,50.165; 40 67.945,52.705; 41 70.485,50.165; 42 70.485,52.705; 43 73.025,50.165; 44 73.025,52.705; 45 75.565,50.165; 46 75.565,52.705; 48 19.685,4.445; 49 22.225,1.905; 50 22.225,4.445; 51 24.765,1.905; 52 24.765,4.445; 53 27.305,1.905; 54 27.305,4.445; 55 29.845,1.905; 56 29.845,4.445; 57 32.385,1.905; 58 32.385,4.445; 59 34.925,1.905; 60 34.925,4.445; 61 37.465,1.905; 62 37.465,4.445; 63 40.005,1.905; 64 40.005,4.445; 65 42.545,1.905; 66 42.545,4.445; 67 45.085,1.905; 68 45.085,4.445; 69 47.625,1.905; 70 47.625,4.445; 71 50.165,1.905; 72 50.165,4.445; 73 52.705,1.905; 74 52.705,4.445; 75 55.245,1.905; 76 55.245,4.445; 77 57.785,1.905; 78 57.785,4.445; 79 60.325,1.905; 80 60.325,4.445; 81 62.865,1.905; 82 62.865,4.445; 83 65.405,1.905; 84 65.405,4.445; 85 67.945,1.905; 86 67.945,4.445; 87 70.485,1.905; 88 70.485,4.445; 89 73.025,1.905; 90 73.025,4.445; 91 75.565,1.905; 92 75.565,4.445 | drill 3.175: P$1 14.605,3.175; P$2 80.645,6.35; P$3 80.645,48.26
EPIC_LCC68 = smd 1.524 x 0.762: P$1 -12.065,10.16; P$2 -12.065,8.89; P$3 -12.065,7.62; P$4 -12.065,6.35; P$5 -12.065,5.08; P$6 -12.065,3.81; P$7 -12.065,2.54; P$8 -12.065,1.27; P$9 -12.065,0; P$10 -12.065,-1.27; P$11 -12.065,-2.54; P$12 -12.065,-3.81; P$13 -12.065,-5.08; P$14 -12.065,-6.35; P$15 -12.065,-7.62; P$16 -12.065,-8.89; P$17 -12.065,-10.16; P$35 12.065,-10.16; P$36 12.065,-8.89; P$37 12.065,-7.62; P$38 12.065,-6.35; P$39 12.065,-5.08; P$40 12.065,-3.81; P$41 12.065,-2.54; P$42 12.065,-1.27; P$43 12.065,0; P$44 12.065,1.27; P$45 12.065,2.54; P$46 12.065,3.81; P$47 12.065,5.08; P$48 12.065,6.35; P$49 12.065,7.62; P$50 12.065,8.89; P$51 12.065,10.16 | smd 0.762 x 1.524: P$18 -10.16,-12.065; P$19 -8.89,-12.065; P$20 -7.62,-12.065; P$21 -6.35,-12.065; P$22 -5.08,-12.065; P$23 -3.81,-12.065; P$24 -2.54,-12.065; P$25 -1.27,-12.065; P$26 0,-12.065; P$27 1.27,-12.065; P$28 2.54,-12.065; P$29 3.81,-12.065; P$30 5.08,-12.065; P$31 6.35,-12.065; P$32 7.62,-12.065; P$33 8.89,-12.065; P$34 10.16,-12.065; P$52 10.16,12.065; P$53 8.89,12.065; P$54 7.62,12.065; P$55 6.35,12.065; P$56 5.08,12.065; P$57 3.81,12.065; P$58 2.54,12.065; P$59 1.27,12.065; P$60 0,12.065; P$61 -1.27,12.065; P$62 -2.54,12.065; P$63 -3.81,12.065; P$64 -5.08,12.065; P$65 -6.35,12.065; P$66 -7.62,12.065; P$67 -8.89,12.065; P$68 -10.16,12.065
SOIC-8 = smd 0.61 x 2.21: 1 -1.905,-2.616; 2 -0.635,-2.616; 3 0.635,-2.616; 4 1.905,-2.616; 5 1.905,2.616; 6 0.635,2.616; 7 -0.635,2.616; 8 -1.905,2.616
FIDUCIAL-1X2.5 = smd 1 x 1: 1 0,0

### Placement (x,y rotation side)
ANT1  86.36,29.21 270 top
C1  56.52,43.18 180 top
C2  54.61,17.14 270 top
C3  80.64,15.24 180 top
C4  82.55,41.27 270 top
C5  56.52,45.09 180 top
C6  52.7,17.14 270 top
C7  80.64,13.34 180 top
C8  84.45,41.27 270 top
C9  82.3,29.69 90 top
C10  85.85,29.69 90 top
C11  71.75,17.78 180 bottom
C13  44.45,33.02 90 top
C14  15.24,45.72 270 top
C15  17.14,13.97 90 top
C16  14.61,13.97 270 top
C17  34.92,13.97 90 top
C18  15.24,41.27 270 top
D1  10.16,52.7 180 top
D2  10.16,50.8 180 top
D3  10.16,48.9 180 top
J1  40.01,27.3 90 top
J2  2.54,12.7 0 top
JP1  50.16,38.1 270 top
JP2  59.69,10.79 0 top
JP3  60.96,8.26 0 top
JP4  69.85,10.79 0 top
JP5  64.77,21.59 0 bottom
R1  13.97,52.7 0 top
R2  13.97,50.8 0 top
R3  13.97,48.9 0 top
R4  16.51,45.72 270 top
R5  52.7,8.26 270 top
R6  53.98,8.26 270 top
R7  55.24,8.26 270 top
R8  56.52,8.26 270 top
R9  34.29,36.2 0 top
R10  34.29,34.92 180 top
R11  36.2,13.97 90 top
R12  37.47,13.97 90 top
R13  41.27,8.26 270 top
R14  43.81,8.26 270 top
R15  42.55,8.26 270 top
R16  45.09,8.26 270 top
R17  47.62,8.26 270 top
R18  48.9,8.26 270 top
R19  35.56,19.68 90 top
R20  34.29,19.68 270 top
R21  33.02,19.68 90 top
R22  31.75,19.68 270 top
R23  30.48,19.68 90 top
R24  29.21,19.68 270 top
R25  34.29,32.38 0 top
R26  34.29,33.66 180 top
R27  20.95,8.26 0 top
R28  84.07,29.21 0 top
R29  26.04,13.97 270 top
R30  24.77,13.97 270 top
R31  36.2,8.26 270 top
R32  32.38,8.26 270 top
R33  46.35,8.26 270 top
R34  50.16,8.26 270 top
R35  53.98,38.1 0 top
R36  53.98,36.83 0 top
R37  53.98,35.56 0 top
R38  53.98,34.29 0 top
R39  76.83,46.35 90 top
R40  74.3,46.35 90 top
R41  71.75,46.35 90 top
R42  69.22,46.35 90 top
R43  71.12,8.26 270 top
R44  72.39,8.26 270 top
R45  73.66,8.26 270 top
R46  74.93,8.26 270 top
R47  75.56,46.35 90 top
R48  73.03,46.35 90 top
R49  70.48,46.35 90 top
R50  67.94,46.35 90 top
R51  27.3,13.97 90 top
R52  57.78,16.51 0 bottom
R53  57.78,13.97 0 bottom
R54  71.75,13.97 0 bottom
R55  57.78,29.21 0 bottom
R56  71.75,16.51 180 bottom
R57  57.78,30.48 0 bottom
S1  10.79,45.72 0 top
S2  10.79,41.27 0 top
SW1  27.3,25.4 90 top
SW2  27.3,34.29 90 top
U1  0,0 0 top
U2  68.58,29.21 0 top
U3  31.11,13.97 180 top
U4  20.95,13.97 180 top
U$2  17.78,40.01 0 bottom
U$3  77.15,7.62 0 top
U$4  24.77,44.45 0 top
U$5  28.57,7.62 0 top

### Tracks (layer width: path | path; a pad name or v marks a point on that pad's centre or on a via)
3V3  (via drill 0.38)
  TOP 0.203: U4.6 20.32,9.53 19.41,8.61 R27.1 | v7.62,50.8 D2.A | D1.A v7.62,52.7 | D3.A v7.62,48.9 | R4.2 v16.51,43.81 | C13.1 v44.45,31.11 44.45,29.6 J1.P$1 | R43.2 v71.12,6.35 | R44.2 v72.39,6.35 | R45.2 v73.66,6.35 | R46.2 v74.93,6.35 | R47.2 v75.56,48.26 | R48.2 v73.03,48.26 | R49.2 v70.48,48.26 | R50.2 67.94,47.62 v66.67,48.9 | R9.2 34.77,36.98 v34.29,37.47
  TOP 0.61: C2.1 v54.61,19.05 53.71,19.05 C6.1 | C8.2 83.45,39.37 v82.55,39.37 C4.2 | C5.1 58.42,44.08 v58.42,43.18 C1.1 | C7.2 78.74,14.34 v78.74,15.24 C3.2 | U4.8 23.57,11.35 v24.13,10.79 | v24.13,10.79 v24.13,12.06 | v24.13,12.06 23.5,11.43 | v24.13,10.79 24.77,11.43 | v25.4,11.43 24.77,11.43 | 24.77,11.43 v24.13,12.06
  TOP 0.762: U2.P$68 v58.42,43.18 | U2.P$17 v54.61,19.05 | U2.P$34 v78.74,15.24 | U2.P$51 v82.55,39.37
  VCC 0.762: v82.55,39.37 80.01,39.37
  BOT 0.61: v44.45,31.11 46.35,29.21 R55.2 R57.2 | R56.2 77.47,16.51 v78.74,15.24
  other vias: 13.97,10.16 15.24,8.89 16.51,10.16 16.51,7.62 13.97,7.62 17.14,12.06 17.78,8.89
  pour VCC: 0,0 0,54.61 80.01,54.61 80.01,0
  pour TOP: 0,20.95 5.08,20.95 5.08,18.41 9.53,13.97 20.95,13.97 20.95,6.99 13.34,6.99 13.34,10.79 0,10.79
BB_GPIO1_16
  TOP 0.203: U1.61 36.2,3.17 R31.2
BB_GPIO1_17
  TOP 0.203: U1.69 46.35,3.17 R33.2
BB_GPIO1_28
  TOP 0.203: U1.58 R32.2
BB_GPIO2_6
  TOP 0.203: R39.2 76.83,48.9 U1.45
BB_GPIO2_7
  TOP 0.203: U1.46 74.3,51.44 R40.2
BB_GPIO2_8
  TOP 0.203: R41.2 71.75,48.9 U1.43
BB_GPIO2_9
  TOP 0.203: R42.2 69.22,50.8 69.85,51.44 71.75,51.44 U1.44
BB_GPIO3_21
  TOP 0.203: U1.71 51.44,3.17 51.44,5.71 50.16,6.99 R34.2
BB_I2C2_SCL  (via drill 0.38)
  TOP 0.203: R11.1 v36.2,12.7 37.47,11.43 38.58,11.43 R13.1 | v30.48,13.34 U3.6
  BOT 0.203: v36.2,12.7 31.11,12.7 v30.48,13.34
BB_I2C2_SCL_ST
  TOP 0.203: U1.65 41.27,3.17 R13.2
BB_I2C2_SDA  (via drill 0.38)
  TOP 0.203: U3.5 28.02,11.35 v27.94,11.43 | R12.1 v37.47,12.7 38.1,12.06 39.22,12.06 R15.1
  BOT 0.203: v37.47,12.7 36.2,11.43 v27.94,11.43
BB_I2C2_SDA_ST
  TOP 0.203: U1.66 R15.2
BB_SPI1_CS0
  TOP 0.203: U1.74 R5.2
BB_SPI1_DI
  TOP 0.203: U1.76 55.24,5.71 53.98,6.99 R6.2
BB_SPI1_DO
  TOP 0.203: U1.75 56.52,3.17 56.52,5.71 55.24,6.99 R7.2
BB_SPI1_SCLK
  TOP 0.203: U1.77 59.05,3.17 59.05,5.71 56.99,7.78 R8.2
BB_UART1_RXD
  TOP 0.203: U1.72 50.16,5.71 48.9,6.99 R18.2
BB_UART1_TXD
  TOP 0.203: R17.2 U1.70
BB_UART2_RXD
  TOP 0.203: U1.68 R16.2
BB_UART2_TXD
  TOP 0.203: U1.67 43.81,3.17 R14.2
CAPE_EEPROM_A0  (via drill 0.38)
  TOP 0.203: R19.1 R20.2 v34.29,18.41 34.29,17.14 33.66,16.51 33.1,16.51 U3.1
  BOT 0.203: SW1.1 33.02,22.23 33.02,19.68 v34.29,18.41
CAPE_EEPROM_A1  (via drill 0.38)
  TOP 0.203: R21.1 R22.2 v31.75,18.41 U3.2
  BOT 0.203: v31.75,18.41 29.21,20.95 29.21,24.77 SW1.2
CAPE_EEPROM_A2
  TOP 0.203: U3.3 R23.1 R24.2
CAPE_EEPROM_WP  (via drill 0.38)
  TOP 0.203: R26.2 R25.1 33.02,32.38 32.38,33.02 SW2.1 | U3.7 v31.75,13.97
  BOT 0.203: v31.75,13.97 28.57,17.14 28.57,30.48 SW2.1
EPIC_ADC0
  TOP 0.203: U2.P$19 JP2.1
EPIC_ADC1
  TOP 0.203: U2.P$20 JP3.1
EPIC_ADC2
  TOP 0.203: U2.P$21 JP2.2
EPIC_ADC3
  TOP 0.203: U2.P$22 JP3.2
EPIC_ADC4
  TOP 0.203: U2.P$23 JP2.3
EPIC_ADC5
  TOP 0.203: U2.P$24 JP3.3
EPIC_ADC6
  TOP 0.203: U2.P$25 JP2.4
EPIC_ADC7
  TOP 0.203: U2.P$26 JP3.4
EPIC_FLASH_WP  (via drill 0.38)
  TOP 0.203: R9.1 R10.2 33.02,34.92 32.38,35.56 SW2.2 | U2.P$37 v82.55,21.59
  BOT 0.203: 32.38,35.56 SW2.2 42.55,46.99 67.31,46.99 70.8,43.5 70.8,31.43 U2.P$37 v82.55,21.59
EPIC_LED1
  TOP 0.203: U2.P$65 62.23,46.35 60.33,48.26 18.89,48.26 R1.2
EPIC_LED2
  TOP 0.203: U2.P$66 60.96,46.35 59.69,47.62 18.41,47.62 15.24,50.8 R2.2
EPIC_LED3
  TOP 0.203: U2.P$67 59.69,46.35 59.05,46.99 17.78,46.99 15.88,48.9 R3.2
EPIC_MISO1
  TOP 0.203: R7.1 55.24,8.89 48.26,15.88 48.26,31.11 JP1.3 50.8,33.66 51.44,33.66 52.07,34.29 52.07,34.92 52.7,35.56 R37.1
EPIC_MISO1_ST
  TOP 0.203: U2.P$4 R37.2
EPIC_MOSI1
  TOP 0.203: R36.1 51.44,36.83 JP1.2 49.53,34.92 48.26,34.92 arc180 48.26,34.29 arc-180 48.26,33.66 arc90 47.62,33.02 47.62,15.24 53.98,8.89 R6.1
EPIC_MOSI1_ST
  TOP 0.203: U2.P$3 R36.2
EPIC_P1.2
  TOP 0.203: U2.P$30 73.66,14.61 JP4.1 71.12,9.53 R43.1
EPIC_P1.5
  TOP 0.203: U2.P$31 74.93,13.34 JP4.2 R44.1
EPIC_P1.6
  TOP 0.203: U2.P$32 76.2,12.06 JP4.3 73.66,9.53 R45.1
EPIC_P1.7
  TOP 0.203: U2.P$33 JP4.4 75.41,8.73 R46.1
EPIC_P2.0  (via drill 0.38)
  TOP 0.203: v82.55,22.86 U2.P$38 | v71.75,43.18 69.22,45.72 R42.1 R50.1
  BOT 0.203: v71.75,43.18 71.75,31.75 U2.P$38 v82.55,22.86
EPIC_P2.1  (via drill 0.38)
  TOP 0.203: v82.55,24.13 U2.P$39 | v73.03,43.18 71.75,44.45 R41.1 R49.1
  BOT 0.203: v73.03,43.18 73.03,31.75 U2.P$39 v82.55,24.13
EPIC_P2.3  (via drill 0.38)
  TOP 0.203: v82.55,25.4 U2.P$40 | v74.3,43.18 R40.1 R48.1
  BOT 0.203: v74.3,43.18 74.3,31.75 U2.P$40 v82.55,25.4
EPIC_P2.6  (via drill 0.38)
  TOP 0.203: v82.55,26.67 U2.P$41 | v75.56,43.18 76.83,44.45 R39.1 R47.1
  BOT 0.203: v75.56,43.18 75.56,31.75 U2.P$41 v82.55,26.67
EPIC_P5.4
  TOP 0.203: U2.P$6 55.24,33.02 JP1.5
EPIC_P5.5
  TOP 0.203: U2.P$7 55.24,31.75 51.44,27.94 51.44,26.67 JP1.6
EPIC_P5.6
  TOP 0.203: U2.P$8 55.24,30.48 52.07,27.3 52.07,24.77 JP1.7
EPIC_P5.7
  TOP 0.203: U2.P$9 55.24,29.21 52.7,26.67 52.7,22.86 JP1.8
EPIC_RFOUT
  TOP 0.457: U2.P$43 C9.1 R28.1
EPIC_RST/NMI  (via drill 0.38)
  TOP 0.203: S2.P$3 S2.P$1 14.87,42.12 C18.1 15.39,41.91 31.11,41.91 37.47,35.56 37.47,29.84 39.37,27.94 39.37,26.67 38.1,25.4 36.2,25.4 35.8,25.01 35.56,25.01 | J1.P$6 35.56,25.01 | 35.56,25.01 v35.56,23.5 | R34.1 v50.16,10.16 | v50.16,16.51 50.16,17.78 52.7,20.32 v54.61,20.32 U2.P$16
  BOT 0.203: v35.56,23.5 35.56,17.78 43.18,10.16 v50.16,10.16 v50.16,16.51 | v54.61,20.32 57.15,17.78 64.14,17.78 65.41,16.51 JP5.11
  BOT 0.61: JP5.11 R56.1 C11.1
EPIC_SCLK1
  TOP 0.203: R8.1 56.52,8.89 48.9,16.51 48.9,29.21 JP1.4 51.44,31.75 52.07,31.75 arc180 52.07,32.38 arc-180 52.07,33.02 52.7,33.02 53.49,33.81 R38.1
EPIC_SCLK1_ST
  TOP 0.203: U2.P$5 R38.2
EPIC_STE1
  TOP 0.203: R35.1 JP1.1 46.99,34.92 46.99,14.61 52.7,8.89 R5.1
EPIC_STE1_ST
  TOP 0.203: U2.P$2 R35.2
EPIC_TCK  (via drill 0.38)
  TOP 0.203: v54.61,21.59 U2.P$15 | R33.1 v46.35,13.97 | v44.45,23.5 44.45,25.01 J1.P$5
  BOT 0.203: v54.61,21.59 53.98,21.59 | v54.61,21.59 46.35,21.59 v44.45,23.5 44.45,15.88 v46.35,13.97 | v54.61,21.59 55.88,20.32 64.14,20.32 65.41,21.59 JP5.7
EPIC_TDI/TCLK  (via drill 0.38)
  TOP 0.203: U2.P$13 v54.61,24.13
  BOT 0.203: v54.61,24.13 55.88,25.4 64.14,25.4 65.41,26.67 JP5.3
EPIC_TDO/TDI  (via drill 0.38)
  TOP 0.203: U2.P$12 v54.61,25.4
  BOT 0.203: v54.61,25.4 57.15,27.94 64.14,27.94 65.41,29.21 66.04,29.21 66.67,29.21 JP5.1
EPIC_TMS  (via drill 0.38)
  TOP 0.203: U2.P$14 v54.61,22.86
  BOT 0.203: v54.61,22.86 64.14,22.86 65.41,24.13 JP5.5
EPIC_UART0RX  (via drill 0.38)
  TOP 0.203: U2.P$60 v68.58,43.18 | v47.62,39.37 45.72,37.47 45.72,17.78 43.81,15.88 R14.1
  BOT 0.203: v68.58,43.18 66.36,40.96 49.21,40.96 v47.62,39.37
EPIC_UART0TX  (via drill 0.38)
  TOP 0.203: U2.P$59 v69.85,43.18 | v47.62,38.1 46.35,36.83 46.35,17.14 45.09,15.88 R16.1
  BOT 0.203: v69.85,43.18 66.99,40.32 49.85,40.32 v47.62,38.1
EPIC_UART1RX  (via drill 0.38)
  TOP 0.203: U2.P$62 v66.04,43.18 | R17.1 v47.62,11.43 | v38.1,27.3 J1.P$4
  BOT 0.203: v66.04,43.18 65.09,42.23 45.4,42.23 38.1,34.92 v38.1,27.3 38.1,16.51 43.18,11.43 v47.62,11.43 48.9,12.7 48.9,17.14 49.53,17.78 53.34,17.78 57.15,13.97 R53.2
EPIC_UART1TX  (via drill 0.38)
  TOP 0.203: v67.31,43.18 U2.P$61 | 45.09,27.3 J1.P$3 v41.91,27.3 | R18.1 48.9,11.43 v47.62,12.7
  BOT 0.203: v67.31,43.18 65.72,41.59 46.04,41.59 41.91,37.47 v41.91,27.3 41.91,15.24 44.45,12.7 v47.62,12.7 48.26,13.34 48.26,17.78 48.9,18.41 53.98,18.41 55.88,16.51 R52.2
EPIC_USER_INT  (via drill 0.38)
  TOP 0.203: S1.P$3 S1.P$1 14.87,46.57 C14.1 R4.1 17.3,46.2 v17.78,45.72 | U2.P$53 v77.47,43.18
  BOT 0.203: v17.78,45.72 19.68,47.62 67.94,47.62 71.12,44.45 76.2,44.45 v77.47,43.18
FEED
  TOP 0.457: R28.2 C10.1 ANT1.FEED
GND  (via drill 0.38)
  TOP 0.203: R20.1 v34.29,20.95 | C17.2 v34.92,15.24 | U2.P$35 v82.55,19.05 | R26.1 v36.2,33.66 | R10.1 v36.2,34.92 | U4.3 v20.32,18.41 | C15.2 v17.14,15.88 | S2.P$4 S2.P$2 14.87,40.42 C18.2 16.36,40.8 v16.51,40.64 | S1.P$4 S1.P$2 13.55,44.87 14.61,43.81 v15.24,43.81 C14.2 | U3.4 27.38,16.59 v27.3,16.51 | J1.P$2 35.85,30.82 v35.56,31.11 | C13.2 v44.45,34.92 | R24.1 27.46,20.16 v27.3,20.32 | R51.1 27.3,12.7 v26.67,12.06 | R22.1 v31.75,20.95
  TOP 0.61: C1.2 v54.61,43.18 53.98,43.81 v53.98,44.45 | C2.2 v54.61,15.24 53.98,14.61 v53.34,14.61 | C3.1 v82.55,15.24 83.19,14.61 v83.19,13.97 | C7.1 82.55,13.34 | 82.55,13.34 v83.19,13.97 | 82.55,13.34 v83.19,12.7 v83.19,13.97 | C8.1 84.45,43.18 | 84.45,43.18 v83.82,43.81 | v83.82,43.81 v85.09,43.81 84.45,43.18 | C4.1 v82.55,43.18 83.19,43.81 v83.82,43.81 | v53.34,14.61 v52.07,14.61 52.7,15.24 | C6.2 52.7,15.24 | 52.7,15.24 v53.34,14.61 | C5.2 54.61,45.09 | 54.61,45.09 v53.98,44.45 | v53.98,44.45 v53.98,45.72 54.61,45.09 | C16.C 14.61,16.51 | 14.61,16.51 v13.97,17.14 v15.24,17.14 14.61,16.51 | v71.12,15.24 v72.39,15.24
  TOP 0.762: U2.P$1 v54.61,39.37 | U2.P$18 v58.42,15.24 | U2.P$11 v54.61,26.67 | U2.P$29 v72.39,15.24 | v71.12,15.24 U2.P$28 | v78.74,43.18 U2.P$52
  GND 0.61: 80.01,43.18 v82.55,43.18 83.19,43.81 v83.82,43.81 | 80.01,15.24 v82.55,15.24 83.19,14.61 v83.19,13.97
  GND 0.762: v82.55,19.05 80.01,19.05
  BOT 0.61: R54.1 72.23,15.09 v72.39,15.24 v71.12,15.24 | JP5.9 72.39,19.05 | 72.39,19.05 v82.55,19.05 | C11.2 72.23,18.89 72.39,19.05
  other vias: 9.53,4.45 6.99,4.45 4.45,4.45 1.91,4.45 9.53,9.53 6.99,9.53 4.45,9.53 1.91,9.53 5.71,6.99
  pour GND: 0,0 0,54.61 80.01,54.61 80.01,0
  pour TOP: 0,3.81 10.79,3.81 10.79,10.16 0,10.16
N$2  (via drill 0.38)
  other vias: 82.55,20.32
N$3
  BOT 0.61: JP5.13 R54.2
N$9
  TOP 0.203: R1.1 D1.C
N$10
  TOP 0.203: R2.1 D2.C
N$11
  TOP 0.203: R3.1 D3.C
N$18
  BOT 0.203: JP5.12 R52.1
N$20
  BOT 0.203: JP5.14 R53.1
PWR_EN  (via drill 0.38)
  TOP 0.203: R31.1 36.2,8.89 v35.56,9.53 | U4.1 24.69,16.59 v24.77,16.51 26.04,15.24 R29.1 R51.2
  BOT 0.203: v35.56,9.53 23.5,9.53 22.86,10.16 22.86,14.61 v24.77,16.51
PWR_FLG  (via drill 0.38)
  TOP 0.203: R32.1 31.59,8.73 v31.11,8.26 | R30.1 24.45,14.77 v21.59,14.77 U4.2
  BOT 0.203: v21.59,14.77 21.59,10.16 23.5,8.26 v31.11,8.26
RFGND  (via drill 0.38)  (2 unrouted)
  other vias: 85.85,27.18 85.85,26.29 85.85,25.4 85.85,24.51 85.85,22.73 85.85,20.95 85.85,19.18 85.85,31.24 85.85,33.02 85.85,33.91 85.85,35.69 85.85,34.8 85.85,32.13 83.19,30.35 84.07,30.35 85.85,38.35 85.85,36.58 85.85,37.47 85.85,20.07 85.85,23.62 85.85,21.84 85.85,40.13 84.96,30.35 83.19,31.24 82.3,31.24 84.96,31.24 84.07,28.07 83.19,28.07 84.96,28.07 82.3,28.07 85.85,28.07 85.85,18.29 85.85,17.4 85.85,16.51 85.85,15.62 85.85,14.73 85.85,13.84 84.07,31.24 85.85,39.24 85.85,41.02 82.3,33.02 82.3,34.8 82.3,36.58 82.3,38.35 84.07,38.35 84.07,36.58 84.07,34.8 84.07,33.02 84.07,26.29 84.07,24.51 84.07,22.73 84.07,20.95 84.07,19.18 84.07,17.4 84.07,15.62 82.3,17.4 84.07,12.06 84.07,10.29 84.07,8.51 82.3,10.29 84.07,45.47 82.3,45.47 84.07,47.24
  pour TOP (no thermals): 80.64,28.42 80.64,0 86.26,0 86.26,28.42
  pour GND: 80.64,54.61 80.64,0 86.26,0 86.26,54.61
  pour VCC: 80.64,54.61 80.64,0 86.26,0 86.26,54.61
  pour BOT: 80.64,54.61 80.64,0 86.26,0 86.26,54.61
  pour VCC: 80.64,54.61 80.64,29.84 86.36,29.84 86.36,54.61
  pour TOP (no thermals): 80.64,30 86.26,30 86.26,54.61 80.64,54.61
VCCTARGET
  BOT 0.61: JP5.4 64.14,26.67 65.41,27.94 69.85,27.94 70.48,28.57 70.48,29.84 69.85,30.48 R57.1
VCCTOOL
  BOT 0.61: R55.1 JP5.2
VDD_3V3EXP
  TOP 0.203: R11.2 R12.2
  TOP 0.406: R25.2 34.77,31.59 34.29,31.11 34.29,22.23
  pour TOP: 20.95,1.27 20.95,5.08 21.59,5.71 21.59,13.97 27.94,13.97 27.94,22.23 36.83,22.23 36.83,15.88 38.73,15.88 38.73,9.53 27.94,9.53 23.5,5.08 23.5,1.27 22.86,0.64 21.59,0.64
VDD_5V  (1 unrouted)

### Text on the board
tPlace: Epic Cape
bPlace: Epic Cape | Flying Camp Design | www.flyingcampdesign.com | P/N: 10004 | Rev: 1.1.1